# EasyEDA Pro project ProProject_扫描隧道显微镜OpenSTM_2023-08-25.epro, schematic PreAmp
Create Date: 2023-06-15; Page Name: P1; Project Name: 扫描隧道显微镜OpenSTM; Schematic Name: PreAmp; Update Date: 2023-06-16; Add into BOM: yes; Convert to PCB: yes
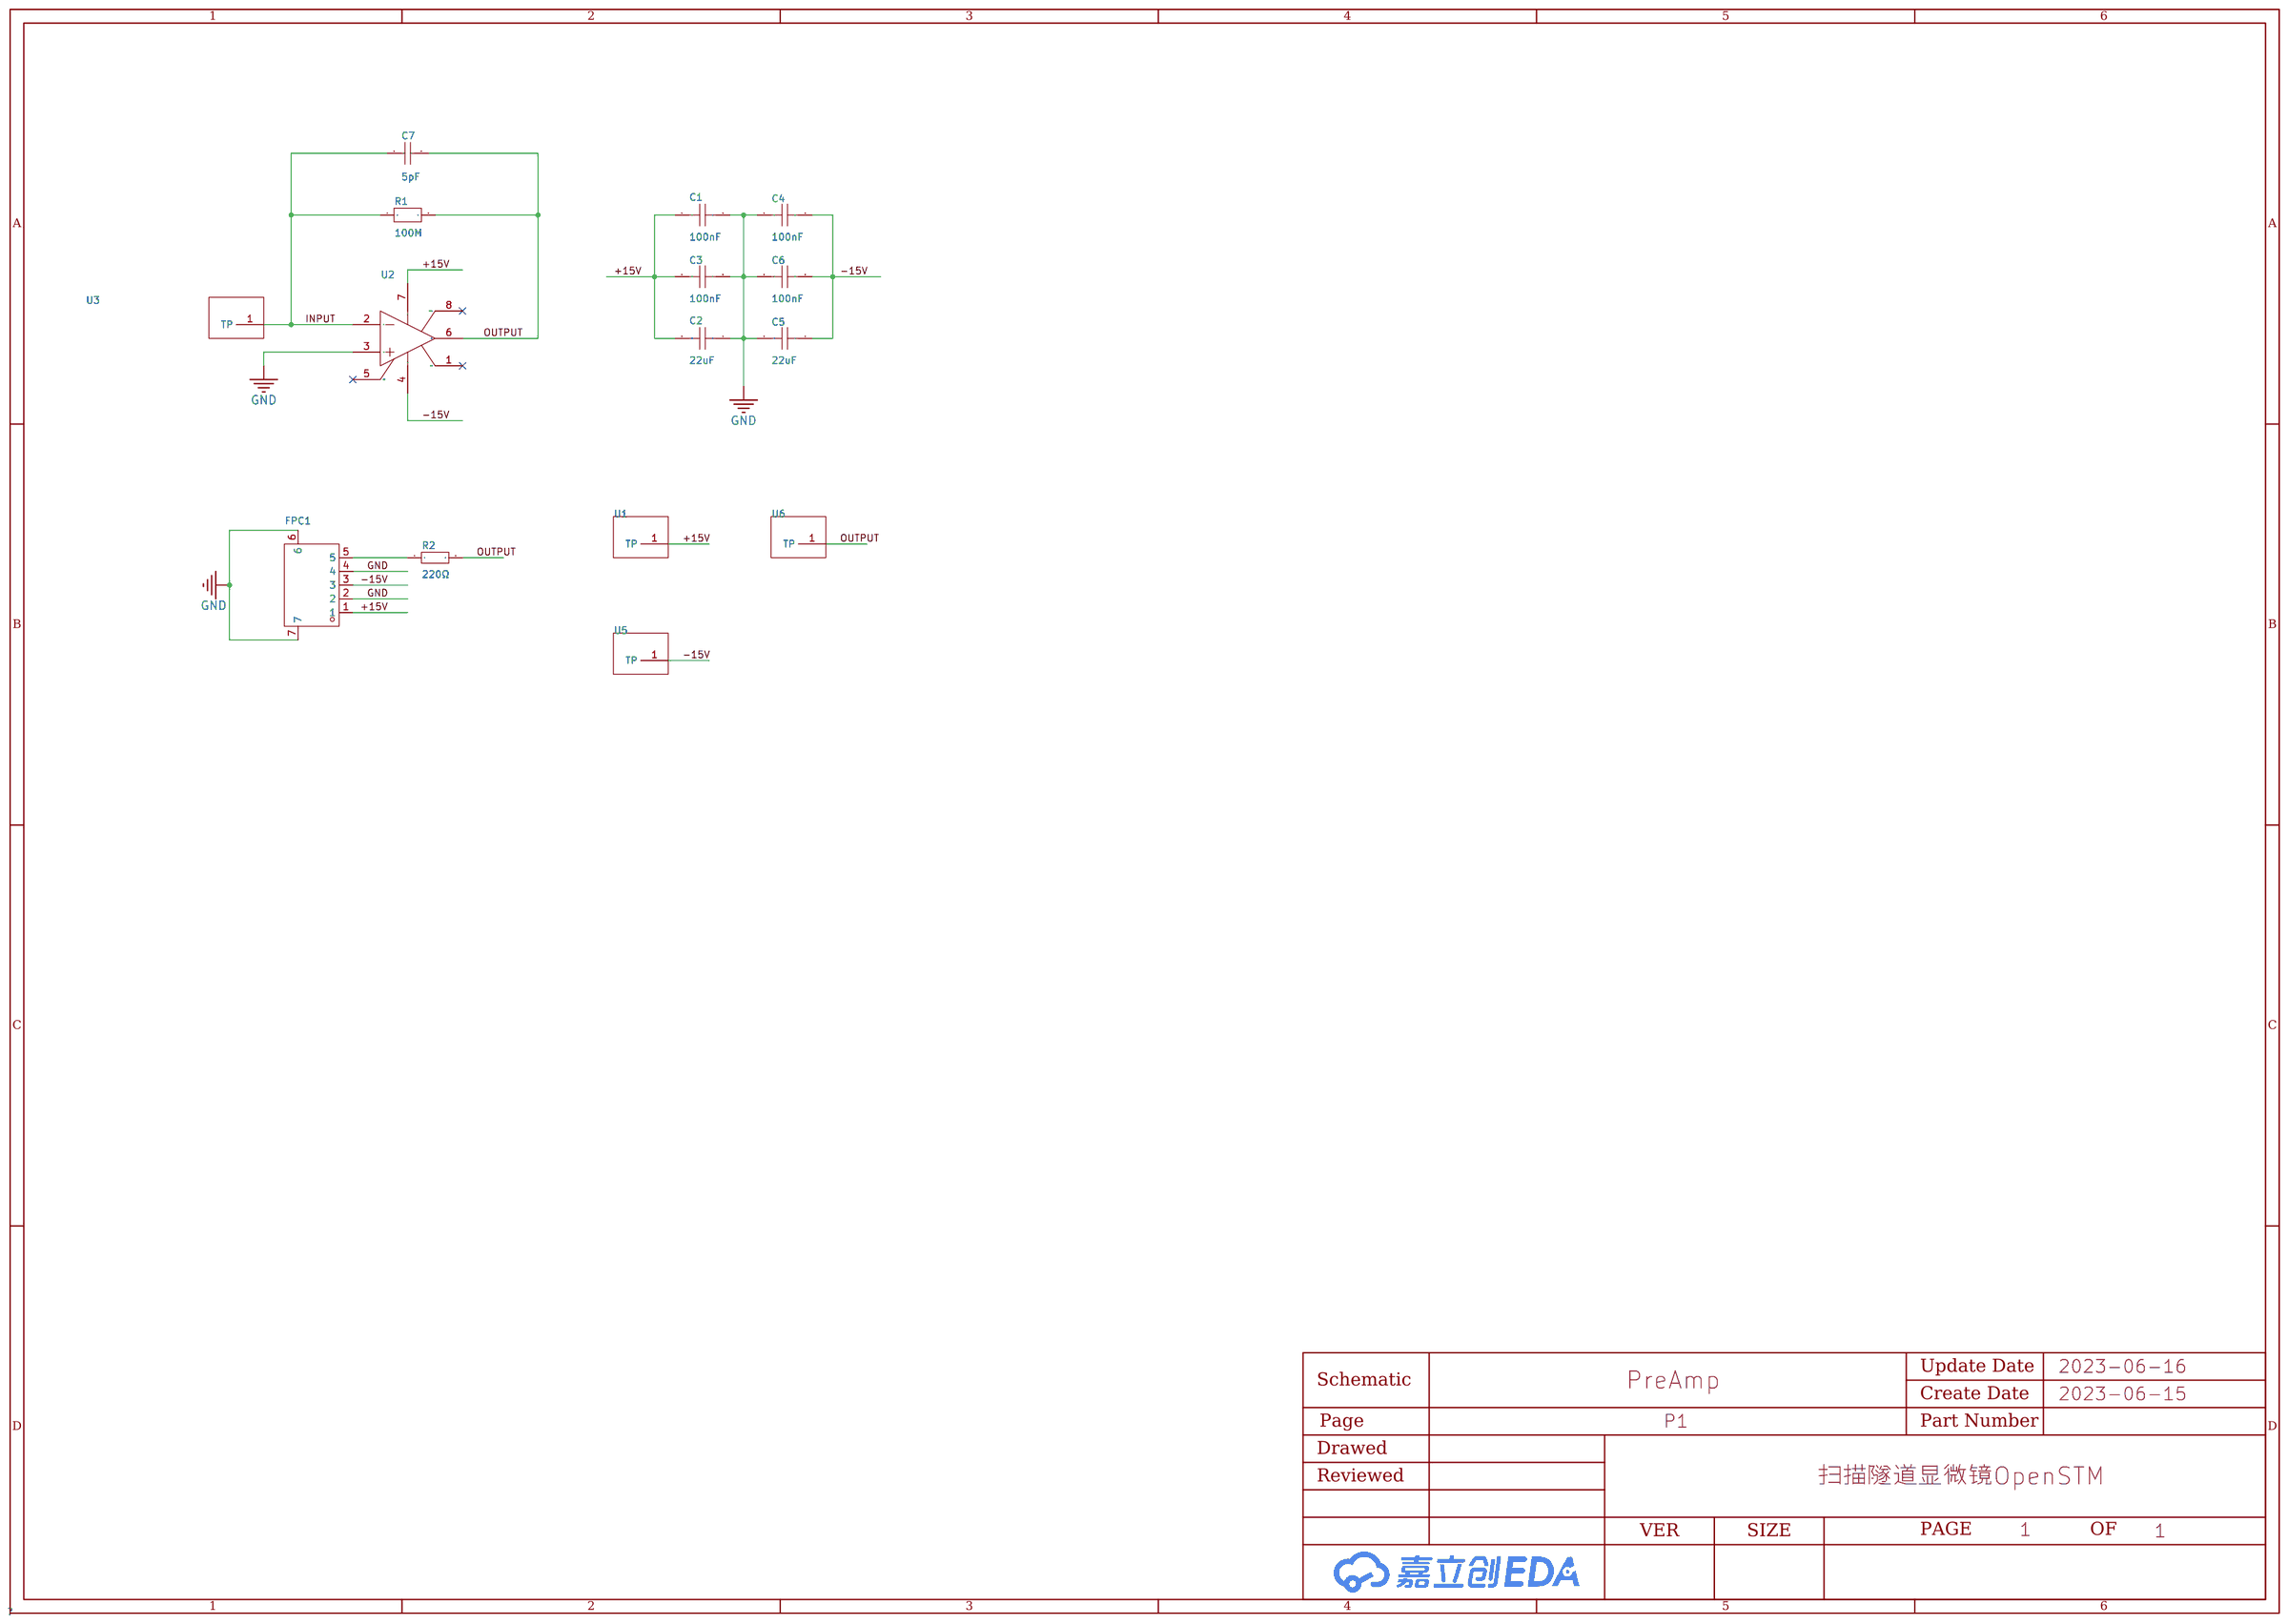
[diagram p4: schematic sheet]

## Parts
C1  100nF  [C0603]
C2  22uF  [C0805]
C3  100nF  [C0603]
C4  100nF  [C0603]
C5  22uF  [C0805]
C6  100nF  [C0603]
C7  5pF  [C0402]
FPC1  -  [FPC-SMD_5P-P0.50_THD0510-05CL-GF]
R1  100M  [R0603]
R2  220Ω  [R0402]
U1  -  [焊接触点square-round-2x1]
U2  -  [SOIC-8_L5.0-W4.0-P1.27-LS6.0-BL]
U3  -  [焊接触点square-round-2x1]
U5  -  [焊接触点square-round-2x1]
U6  -  [焊接触点square-round-2x1]

## Library data of the parts
C1 C3 C4 C6 = CC0603KRX7R9BB104: 容值:100nF;精度:±10%;额定电压:50V;温度系数:X7R;; LCSC Part Name: 100nF ±10% 50V; Supplier Part: C14663; Manufacturer: YAGEO(国巨); Supplier Footprint: 0603; JLCPCB Part Class: Basic Part; Datasheet: https://atta.szlcsc.com/upload/public/pdf/source/20170116/1484561234239.pdf; Supplier: LCSC; Tolerance: ±10%; Voltage Rated: 50V; Temperature Coefficient: X7R
C2 C5 = C2012X5R1V226MT000E: 容值:22uF;精度:±20%;额定电压:35V;温度系数:X5R;; LCSC Part Name: 22uF ±20% 35V; Supplier Part: C338080; Manufacturer: TDK; Supplier Footprint: 0805; JLCPCB Part Class: Extended Part; Datasheet: https://atta.szlcsc.com/upload/public/pdf/source/20181206/C338080_066671AD469AE9D3706F78911D2065BC.pdf; Supplier: LCSC; Tolerance: ±20%; Voltage Rated: 35V; Temperature Coefficient: X5R
C7 = 0402CG5R0C500NT: 容值:5pF;精度:±0.25pF;额定电压:50V;温度系数:C0G;; LCSC Part Name: 5pF±0.25pF50V; Supplier Part: C1573; Manufacturer: FH(风华); Supplier Footprint: 0402; JLCPCB Part Class: ExtendedPart; Datasheet: https://atta.szlcsc.com/upload/public/pdf/source/20170923/C1573_1506149277302988380.pdf; Supplier: LCSC; Tolerance: ±0.25pF; Voltage Rated: 50V; Temperature Coefficient: C0G
FPC1 = THD0510-05CL-GF: 间距:0.5mm;触点数量:5;锁定特性:翻盖式;安装类型:卧贴;触点类型:下接;; LCSC Part Name: 0.5mm P数:5 翻盖式 下接; Supplier Part: C283117; Manufacturer: THD(台华达); Supplier Footprint: SMD,P=0.5mm; JLCPCB Part Class: Extended Part; Datasheet: https://atta.szlcsc.com/upload/public/pdf/source/20181023/C283117_FD142D424EBF2D5652708496952DDE0A.pdf; Supplier: LCSC; Pitch: 0.5mm; Number of Contacts: 5; Locking Feature: 翻盖式; Mounting Type: 卧贴; Contact Type: 下接; Height Above Board: 1mm; FFC, FCB Thickness: 0.3mm
R1 = HMC0603JT100M: 电阻类型:厚膜电阻;阻值:100M;精度:±5%;功率:100mW;温度系数:-;最大工作电压:50V;工作温度范围:-55~+125;; LCSC Part Name: 100M ±5%; Supplier Part: C346514; Manufacturer: SEI(Stackpole Electronics Inc.); Supplier Footprint: 0603; JLCPCB Part Class: Extended Part; Datasheet: https://atta.szlcsc.com/upload/public/pdf/source/20190409/C346514_D73CA75AC0C72F0B56807B63BF1CF3AC.pdf; Supplier: LCSC; Type: 厚膜电阻; Tolerance: ±5%; Power(Watts): 100mW; Overload Voltage (Max): 50V; Operating Temperature Range: -55~+125
R2 = 0402WGF2200TCE: 电阻类型:厚膜电阻;阻值:220Ω;精度:±1%;功率:1/16W;温度系数:±100ppm/;最大工作电压:50V;工作温度范围:-55~+155;; LCSC Part Name: 220Ω±1%; Supplier Part: C25091; Manufacturer: UNI-ROYAL(厚声); Supplier Footprint: 0402; JLCPCB Part Class: BasicPart; Datasheet: https://atta.szlcsc.com/upload/public/pdf/source/20200306/C422600_1E6D84923E4A46A82E41ADD87F860B5C.pdf; Supplier: LCSC; Type: 厚膜电阻; Tolerance: ±1%; Power(Watts): 1/16W; Temperature Coefficient: ±100ppm/; Overload Voltage (Max): 50V; Operating Temperature Range: -55~+155
U1 U3 U5 U6 = 焊接触点square-round-2x1
U2 = OPA627AU/2K5: 运放类型:General Purpose;增益带宽积（GBP）:16MHz;压摆率（SR）:55 V/us;电源电压:9V ~ 36V, ±4.5V ~ 18V;各通道供电电流:7mA;; Supplier Part: C22061; Manufacturer: TI(德州仪器); Supplier Footprint: SOIC-8_150mil; JLCPCB Part Class: Extended Part; Datasheet: https://atta.szlcsc.com/upload/public/pdf/source/20180115/C22061_15160149544581269391.pdf; Supplier: LCSC; Amplifier Type: General Purpose; Gain Bandwidth Product（GBP）: 16MHz; Slew Rate（SR）: 55 V/us; Supply Voltage（Single）: 9V ~ 36V, ±4.5V ~ 18V; Iq per channel (Typ): 7mA; Operating Temperature: -25~85

## Nets
+15V: C1.1 C2.2 C3.1 FPC1.1 U1.1(TP) U2.7(V+)
-15V: C4.2 C5.1 C6.2 FPC1.3 U2.4(V-) U5.1(TP)
GND: C1.2 C2.1 C3.2 C4.1 C5.2 C6.1 FPC1.2 FPC1.4 FPC1.6 FPC1.7 U2.3(IN+)
INPUT: C7.1 R1.1 U2.2(IN-) U3.1(TP)
OUTPUT: C7.2 R1.2 R2.2 U2.6(OUT) U6.1(TP)
$1N2383: FPC1.5 R2.1

Not connected (* = marked no-connect by the designer): U2 1(Offset Trim)* 5(Offset Trim)* 8(No Internal Connection)*
